# Altium schematic sheet P01 Version.SchDoc
size 297 x 209 mm
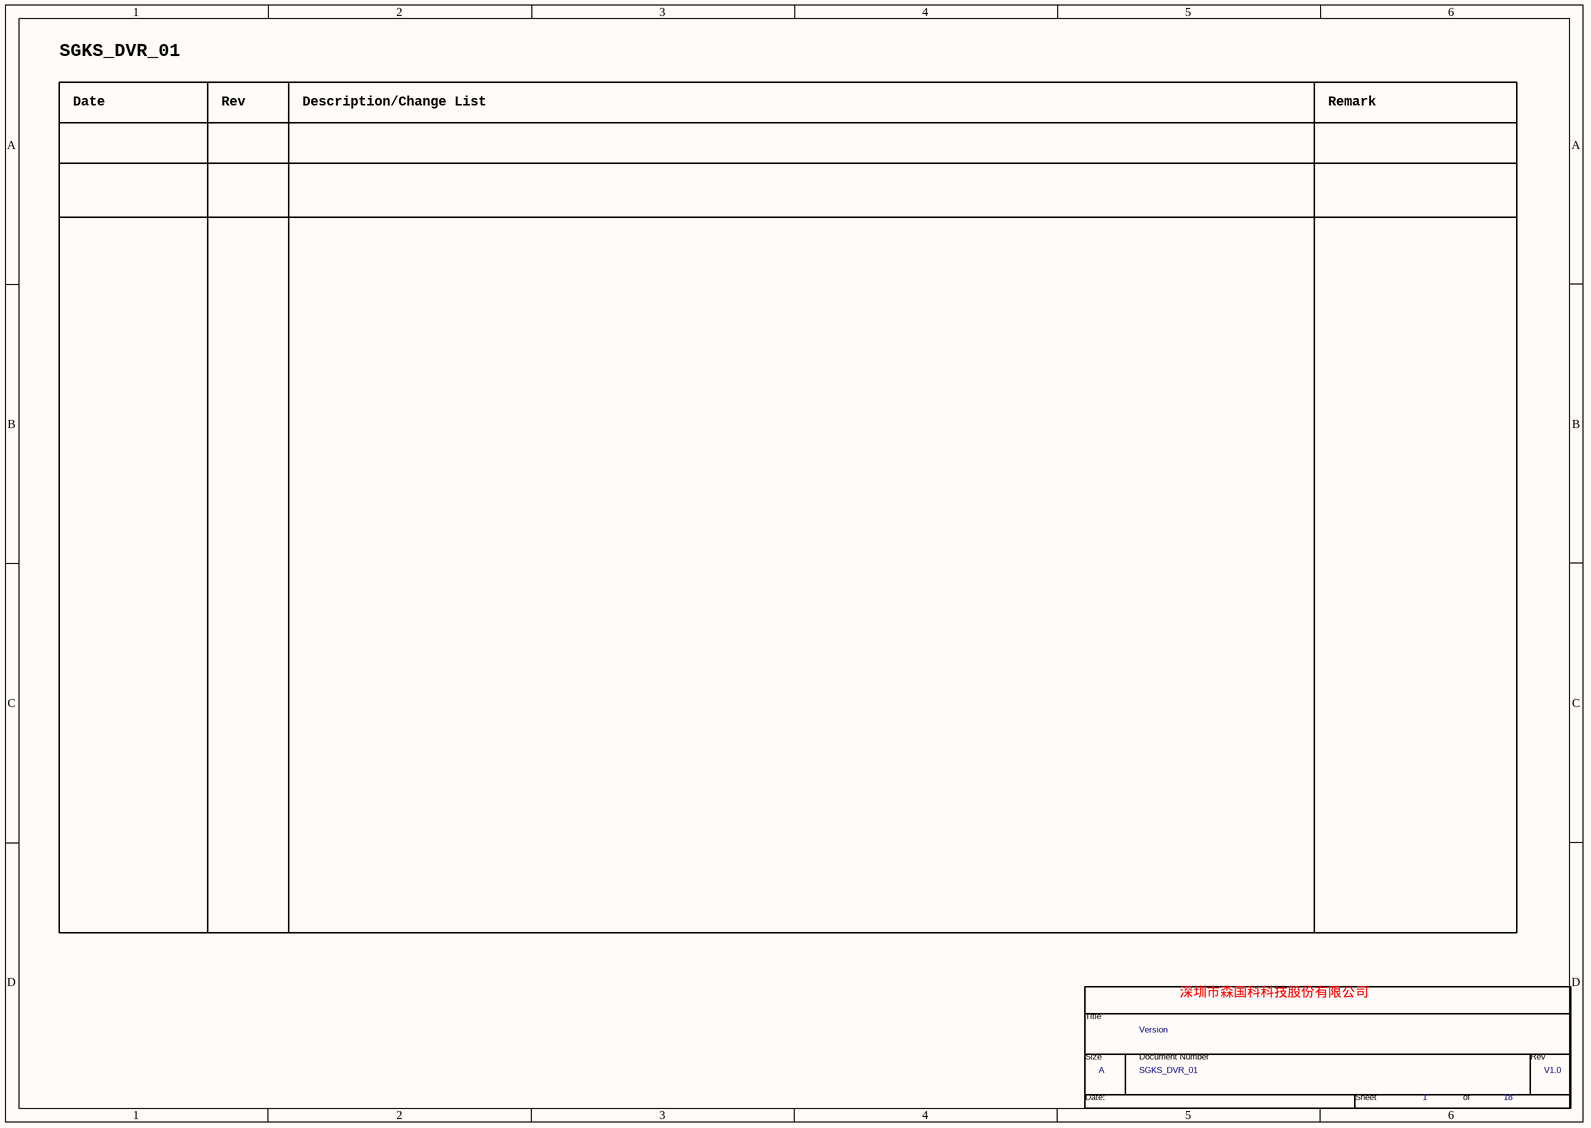
[diagram p0: P01 Version.SchDoc]

## Parts
*  Page Count: 18  Page Number: 1  Page Size: A  Title: Version  RevCode: V1.0  Doc: SGKS_DVR_01  (hidden comment: TitleBlock0)  (graphical)

## Notes on the sheet
- SGKS_DVR_01
- Date
- Rev
- Description/Change List
- Remark
- 深圳市森国科科技股份有限公司
- (in symbol TitleBlock0) Title; Size; Document Number; Rev; Date:; Sheet; of

## Library data of the parts
* = TitleBlock0: Page Create Date: March  8, 1995